# Altium schematic sheet 05_USB.SchDoc
size A4; Revision: A
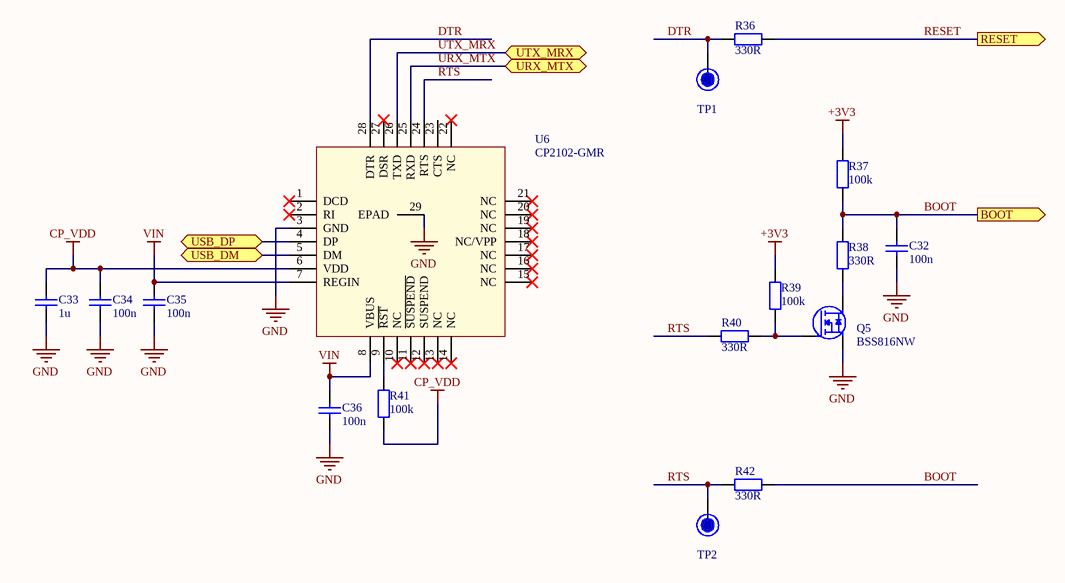
[diagram p0: 05_USB.SchDoc]

## Parts
C32  100n  [C0603_IPC_MD]  (no BOM)
C33  1u  [C0603_IPC_MD]
C34  100n  [C0603_IPC_MD]
C35  100n  [C0603_IPC_MD]
C36  100n  [C0603_IPC_MD]
Q5  BSS816NW  [SOT323]  (no BOM)
R36  330R  [R0603_IPC_MD]
R37  100k  [R0603_IPC_MD]  (no BOM)
R38  330R  [R0603_IPC_MD]  (no BOM)
R39  100k  [R0603_IPC_MD]  (no BOM)
R40  330R  [R0603_IPC_MD]  (no BOM)
R41  100k  [R0603_IPC_MD]
R42  330R  [R0603_IPC_MD]
TP1  RTS  [TestPoint_1M5]  (value not drawn)  (no BOM)
TP2  DTR  [TestPoint_1M5]  (value not drawn)  (no BOM)
U6  CP2102-GMR  [QFN28_(SL)]

## Ports
BOOT (out), RESET (out), URX_MTX, USB_DM, USB_DP, UTX_MRX

## Nets
+3V3: R37.2 R39.2
CP_VDD: C33.2 C34.2 R41.1 U6.6(VDD)
GND: C32.1 C33.1 C34.1 C35.1 C36.1 Q5.2(S) U6.3(GND) U6.29(EPAD)
VIN: C35.2 C36.2 U6.7(REGIN) U6.8(VBUS)
BOOT: C32.2 R37.1 R38.1 R42.2 ; port BOOT
DTR: R36.2 TP1.0 U6.28(DTR)
RESET: R36.1 ; port RESET
RTS: R40.1 R42.1 TP2.0 U6.24(RTS)
URX_MTX: U6.25(RXD) ; port URX_MTX
USB_DM: U6.5(DM) ; port USB_DM
USB_DP: U6.4(DP) ; port USB_DP
UTX_MRX: U6.26(TXD) ; port UTX_MRX
NetQ5_1: Q5.1(G) R39.1 R40.2
NetQ5_3: Q5.3(D) R38.2
NetR41_2: R41.2 U6.9(~{RST})

Not connected (* = marked no-connect by the designer): U6 1(DCD)* 2(RI)* 10(NC)* 11(~{SUSPEND})* 12(SUSPEND)* 13(NC)* 14(NC)* 15(NC)* 16(NC)* 17(NC)* 18(NC/VPP)* 19(NC)* 20(NC)* 21(NC)* 22(NC)* 23(CTS) 27(DSR)*

## Notes on the sheet
- Title
- Size:
- Date:
- A4
- Number:
- Time:
- Revision:
- Sheet
- of
- File:

## Library data of the parts
C32 C34-C36 = CL10B104KO8NNNC: CAP CER 0.1UF 16V X7R 0603; Manufacturer: Samsung Electro-Mechanics; Manufacturer Part Number: CL10B104KO8NNNC; Voltage: 16V; Value: 100n; Dielectric: X7R; Supplier 1: Digi-Key; Supplier Part Number 1: 1276-1005-1-ND
C33 = CL10B105MO8NNWC: CAP CER 1UF 16V X7R 0603; Manufacturer: Samsung Electro-Mechanics; Manufacturer Part Number: CL10B105MO8NNWC; Voltage: 16V; Value: 1u; Dielectric: X7R; Supplier 1: Digi-Key; Supplier Part Number 1: 1276-6524-1-ND
Q5 = BSS816: N-Channel Logic Level Enhancement Mode Field Effect Transistor; Manufacturer: Infineon Technologies; Manufacturer Part Number: BSS816NW; Supplier 1: Digi-Key; Supplier Part Number 1: BSS816NWH6327XTSA1CT-ND
R36 R38 R40 R42 = CR0603-JW-331ELF: RES SMD 330 OHM 5% 1/10W 0603; Manufacturer: Bourns Inc.; Value: 330R; Tolarance: 5%; Manufacturer Part Number: CR0603-JW-331ELF; Supplier 1: Digi-Key; Supplier Part Number 1: CR0603-JW-331ELFCT-ND
R37 R39 R41 = RMCF0603FT100K: RES 100K OHM 1% 1/10W 0603; Manufacturer: Bourns Inc.; Value: 100k; Tolarance: 1%; Manufacturer Part Number: RMCF0603FT100K; Supplier 1: Digi-Key; Supplier Part Number 1: RMCF0603FT100KCT-ND
TP1 TP2 = TP: Test Point
U6 = CP2102-GMR: IC USB-TO-UART BRIDGE 28VQFN; Manufacturer: Silicon Labs; Manufacturer Part Number: CP2102-GMR; Supplier 1: Digi-Key; Supplier Part Number 1: 336-1160-1-ND